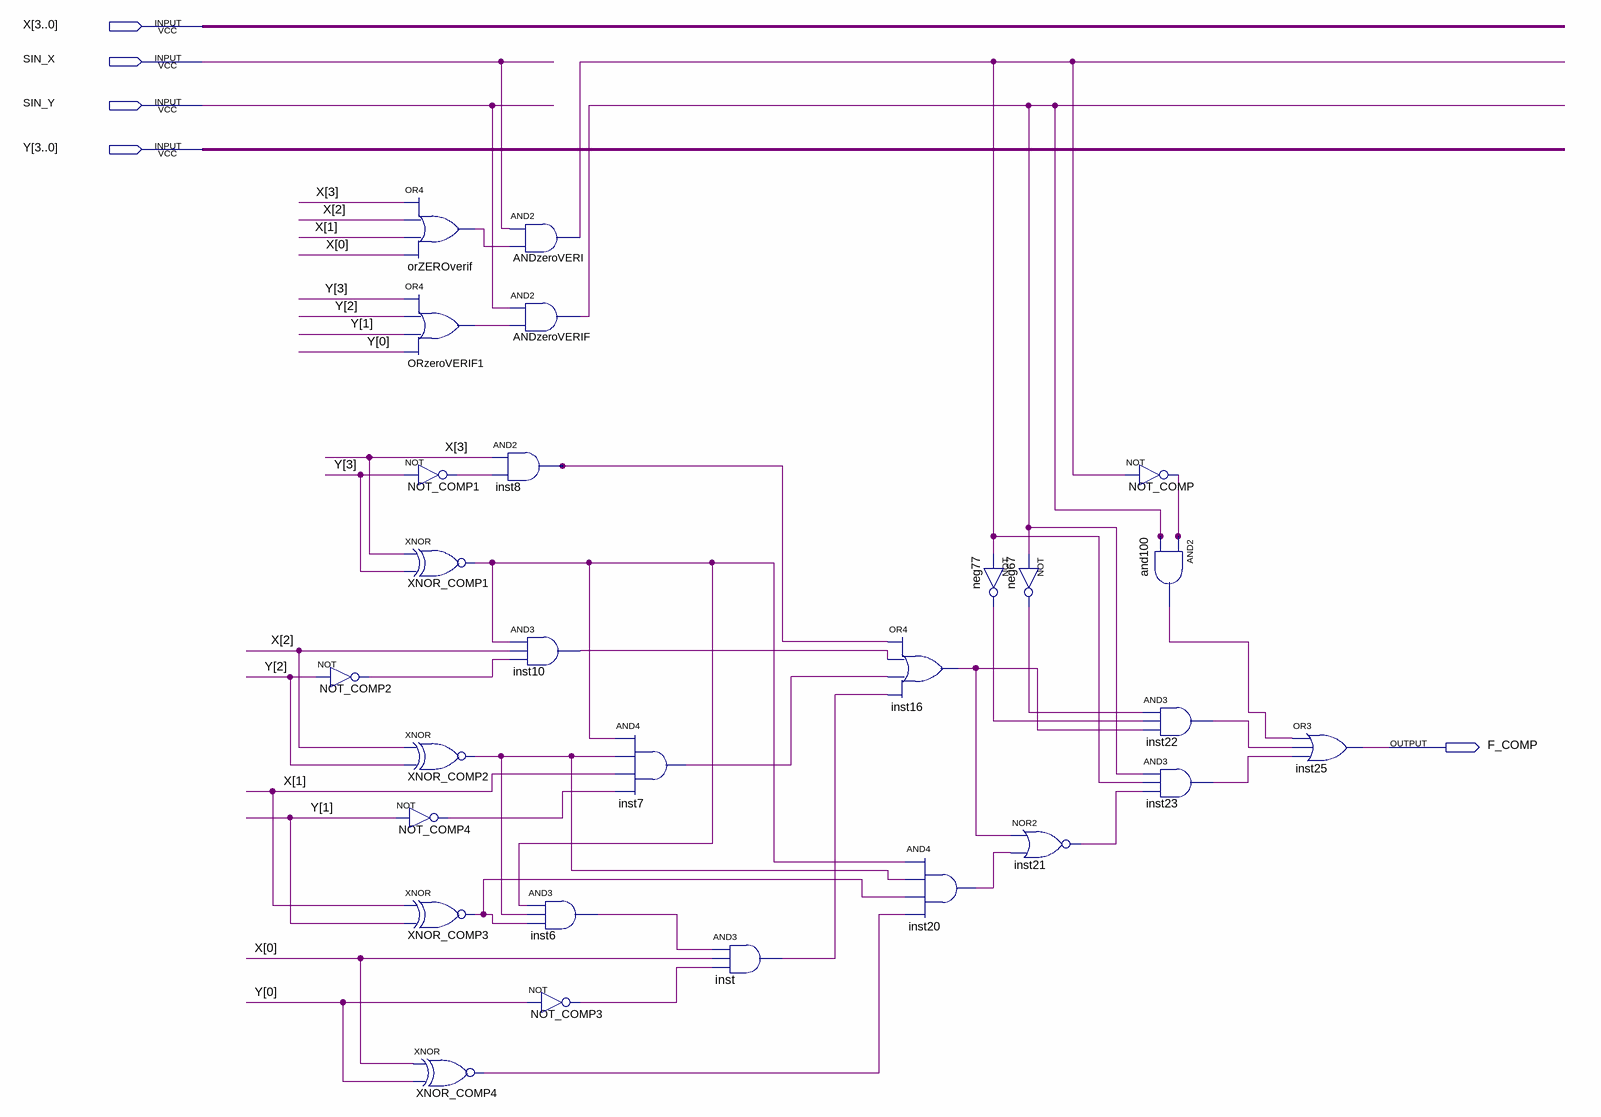
[diagram p0: schematic sheet]
// Quartus schematic MaiorMenor.bdf as structural Verilog: 27 symbols, 5 pins
module MaiorMenor (
  input  [3:0] X,
  input  SIN_X,
  input  SIN_Y,
  input  [3:0] Y,
  output F_COMP
);

  wire and100_out, ANDzeroVERI_out, ANDzeroVERIF_out, inst6_out, inst7_out, inst8_out, inst10_out,
       inst16_out, inst20_out, inst21_out, inst22_out, inst23_out, inst_out, neg67_out, neg77_out,
       NOT_COMP1_out, NOT_COMP2_out, NOT_COMP3_out, NOT_COMP4_out, NOT_COMP_out, ORzeroVERIF1_out,
       orZEROverif_out, XNOR_COMP1_out, XNOR_COMP2_out, XNOR_COMP3_out, XNOR_COMP4_out;

  not NOT_COMP2 (NOT_COMP2_out, Y[2]);
  or orZEROverif (orZEROverif_out, X[3], X[2], X[1], X[0]);
  or ORzeroVERIF1 (ORzeroVERIF1_out, Y[3], Y[2], Y[1], Y[0]);
  not NOT_COMP1 (NOT_COMP1_out, Y[3]);
  xnor XNOR_COMP1 (XNOR_COMP1_out, X[3], Y[3]);
  xnor XNOR_COMP2 (XNOR_COMP2_out, X[2], Y[2]);
  not NOT_COMP4 (NOT_COMP4_out, Y[1]);
  xnor XNOR_COMP3 (XNOR_COMP3_out, X[1], Y[1]);
  xnor XNOR_COMP4 (XNOR_COMP4_out, X[0], Y[0]);
  and ANDzeroVERI (ANDzeroVERI_out, SIN_X, orZEROverif_out);
  and ANDzeroVERIF (ANDzeroVERIF_out, SIN_Y, ORzeroVERIF1_out);
  and inst8 (inst8_out, X[3], NOT_COMP1_out);
  and inst10 (inst10_out, XNOR_COMP1_out, X[2], NOT_COMP2_out);
  and inst6 (inst6_out, XNOR_COMP1_out, XNOR_COMP2_out, XNOR_COMP3_out);
  not NOT_COMP3 (NOT_COMP3_out, Y[0]);
  and inst7 (inst7_out, XNOR_COMP1_out, XNOR_COMP2_out, X[1], NOT_COMP4_out);
  and inst (inst_out, inst6_out, X[0], NOT_COMP3_out);
  or inst16 (inst16_out, inst8_out, inst10_out, inst7_out, inst_out);
  and inst20 (inst20_out, XNOR_COMP1_out, XNOR_COMP2_out, XNOR_COMP3_out, XNOR_COMP4_out);
  not neg77 (neg77_out, ANDzeroVERI_out);
  not neg67 (neg67_out, ANDzeroVERIF_out);
  nor inst21 (inst21_out, inst16_out, inst20_out);
  not NOT_COMP (NOT_COMP_out, ANDzeroVERI_out);
  and and100 (and100_out, NOT_COMP_out, ANDzeroVERIF_out);
  and inst22 (inst22_out, neg67_out, neg77_out, inst16_out);
  and inst23 (inst23_out, ANDzeroVERIF_out, ANDzeroVERI_out, inst21_out);
  or inst25 (F_COMP, and100_out, inst22_out, inst23_out);
endmodule
